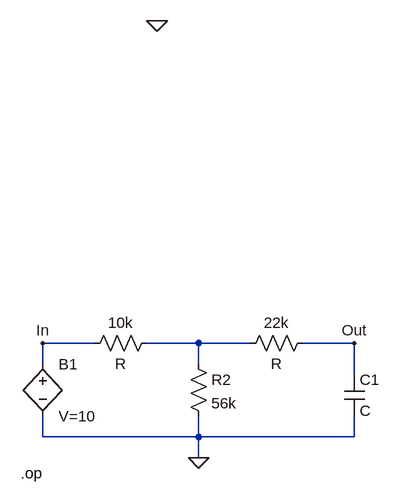
[diagram p0: schematic Draft3.asc]
Draft3.asc, the LTspice schematic file:
Version 4
SHEET 1 880 680
WIRE 0 80 -80 80
WIRE 160 80 80 80
WIRE 240 80 160 80
WIRE 400 80 320 80
WIRE -80 112 -80 80
WIRE 160 112 160 80
WIRE 400 128 400 80
WIRE -80 224 -80 192
WIRE 160 224 160 192
WIRE 160 224 -80 224
WIRE 400 224 400 192
WIRE 400 224 160 224
WIRE 160 256 160 224
FLAG 96 -416 0
FLAG 160 256 0
FLAG -80 80 In
FLAG 400 80 Out
SYMBOL res 96 64 R90
WINDOW 0 0 56 VBottom 2
WINDOW 3 32 56 VTop 2
SYMATTR InstName 10k
SYMBOL res 144 96 R0
SYMATTR InstName R2
SYMATTR Value 56k
SYMBOL res 336 64 R90
WINDOW 0 0 56 VBottom 2
WINDOW 3 32 56 VTop 2
SYMATTR InstName 22k
SYMBOL cap 384 128 R0
SYMATTR InstName C1
SYMBOL bv -80 96 R0
SYMATTR InstName B1
SYMATTR Value V=10
TEXT -114 280 Left 2 !.op

The netlist it stands for:
* Draft3.asc
R§10k N001 In R
R2 N001 0 56k
R§22k Out N001 R
C1 Out 0 C
B1 In 0 V=10
.op
.backanno
.end